# EAGLE design pc_ads1292r_brk (EAGLE 6.4)

## Sheet 1 of 2
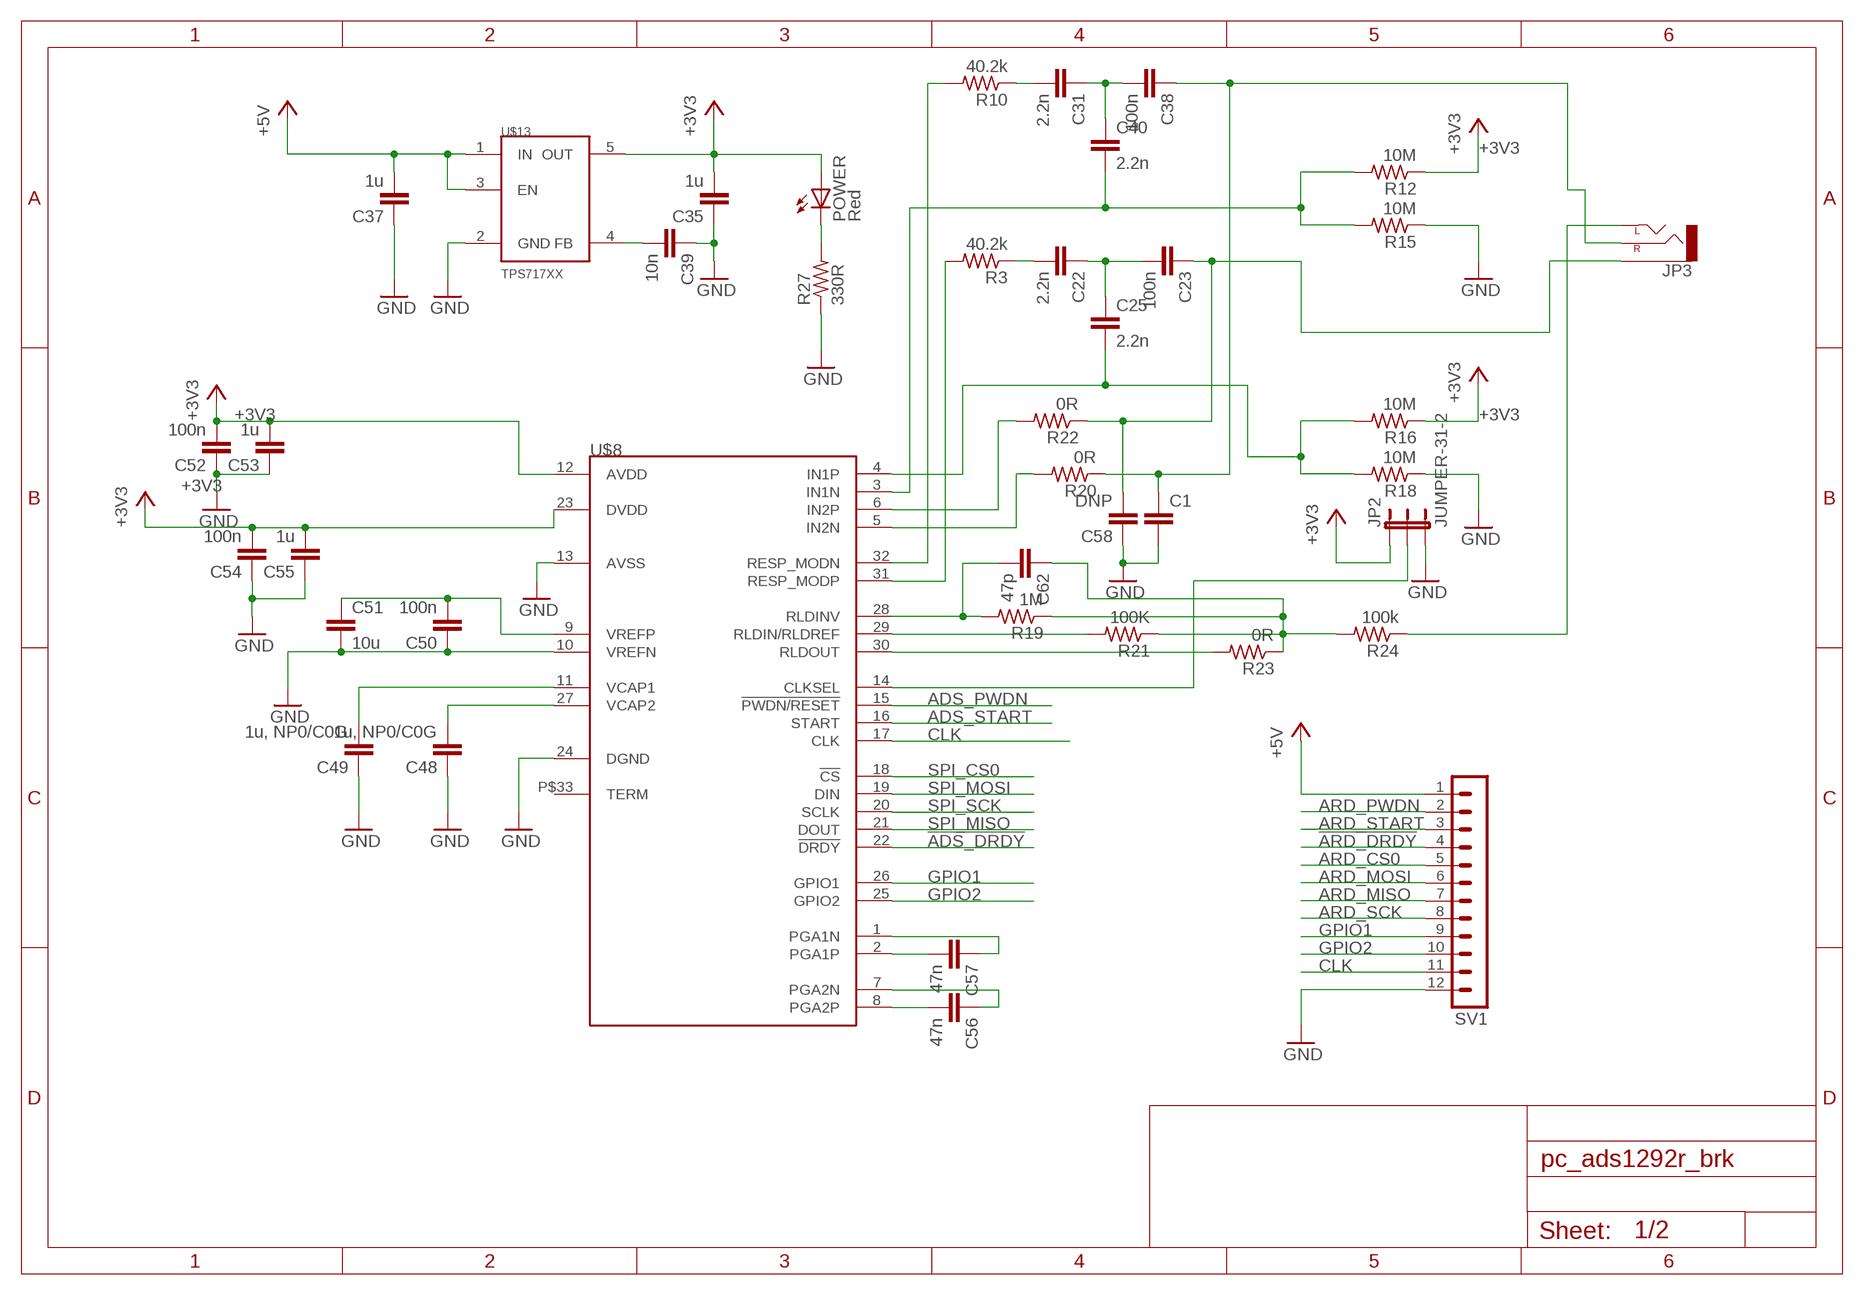
[diagram p0: schematic, sheet 1]

### Parts
C1  C-EUC0402  [C0402]
C22  2.2n  C-EUC0402  [C0402]
C23  100n  C-EUC0402  [C0402]
C25  2.2n  C-EUC0402  [C0402]
C31  2.2n  C-EUC0402  [C0402]
C35  1u  C-EUC0402  [C0402]
C37  1u  C-EUC0402  [C0402]
C38  100n  C-EUC0402  [C0402]
C39  10n  C-EUC0402  [C0402]
C40  2.2n  C-EUC0402  [C0402]
C48  1u, NP0/C0G  C-EUC0402  [C0402]
C49  1u, NP0/C0G  C-EUC0402  [C0402]
C50  100n  C-EUC0402  [C0402]
C51  10u  C-EUC0603  [C0603]
C52  100n  C-EUC0402  [C0402]
C53  1u  C-EUC0402  [C0402]
C54  100n  C-EUC0402  [C0402]
C55  1u  C-EUC0402  [C0402]
C56  47n  C-EUC0402  [C0402]
C57  47n  C-EUC0402  [C0402]
C58  DNP  C-EUC0402  [C0402]
C62  47p  C-EUC0402  [C0402]
JP2  JUMPER-31-2  [SJ_3_PASTE1&2]
JP3  AUDIO-JACKSMD2  [AUDIO-JACK-3.5MM-SMD]
POWER  Red  LEDCHIPLED_0603  [CHIPLED_0603]
R3  40.2k  R-US_R0402  [R0402]
R10  40.2k  R-US_R0402  [R0402]
R12  10M  R-US_R0402  [R0402]
R15  10M  R-US_R0402  [R0402]
R16  10M  R-US_R0402  [R0402]
R18  10M  R-US_R0402  [R0402]
R19  1M  R-US_R0402  [R0402]
R20  0R  R-US_R0402  [R0402]
R21  100K  R-US_R0402  [R0402]
R22  0R  R-US_R0402  [R0402]
R23  0R  R-US_R0402  [R0402]
R24  100k  R-US_R0402  [R0402]
R27  330R  R-US_R0402  [R0402]
SV1  MA12-1  [MA12-1]
U$8  ADS1292RPVQFN32  [S-PVQFN-N32]
U$13  TPS717XX  [SC70-5]

### Nets
!ADS_DRDY: U$8.22(!DRDY) ; also sheet 2
!ARD_DRDY: SV1.4 ; also sheet 2
+3V3: C35.2 C52.2 C53.2 C54.2 C55.2 JP2.1 POWER.A R12.1 R16.1 U$8.12(AVDD) U$8.23(DVDD) U$13.5(OUT) ; also sheet 2
+5V: C37.2 SV1.1 U$13.1(IN) U$13.3(EN) ; also sheet 2
ADS_PWDN: U$8.15(!PWDN/RESET) ; also sheet 2
ADS_START: U$8.16(START) ; also sheet 2
ARD_CS0: SV1.5 ; also sheet 2
ARD_MISO: SV1.7 ; also sheet 2
ARD_MOSI: SV1.6 ; also sheet 2
ARD_PWDN: SV1.2 ; also sheet 2
ARD_SCK: SV1.8 ; also sheet 2
ARD_START: SV1.3 ; also sheet 2
CLK: SV1.11 U$8.17(CLK)
GND: C1.2 C35.1 C37.1 C39.1 C48.1 C49.1 C50.1 C51.2 C52.1 C53.1 C54.1 C55.1 C58.1 JP2.3 R15.1 R18.1 R27.1 SV1.12 U$8.10(VREFN) U$8.13(AVSS) U$8.24(DGND) U$13.2(GND)
GPIO1: SV1.9 U$8.26(GPIO1)
GPIO2: SV1.10 U$8.25(GPIO2)
N$1: C39.2 U$13.4(FB)
N$7: POWER.C R27.2
N$8: R3.2 U$8.31(RESP_MODP)
N$10: C22.2 R3.1
N$11: C22.1 C23.2 C25.1
N$12: R22.2 U$8.6(IN2P)
N$14: R20.2 U$8.5(IN2N)
N$19: C48.2 U$8.27(VCAP2)
N$26: R10.2 U$8.32(RESP_MODN)
N$28: C31.2 R10.1
N$29: C31.1 C38.2 C40.1
N$30: C1.1 C38.1 JP3.RING(RIGHT) R20.1
N$31: C40.2 R12.2 R15.2 U$8.3(IN1N)
N$32: C25.2 R16.2 R18.2 U$8.4(IN1P)
N$33: R21.2 U$8.29(RLDIN/RLDREF)
N$34: C62.2 R19.2 U$8.28(RLDINV)
N$35: C62.1 R19.1 R21.1 R23.1 R24.2
N$36: C49.2 U$8.11(VCAP1)
N$37: C56.2 U$8.8(PGA2P)
N$38: C56.1 U$8.7(PGA2N)
N$40: C50.2 C51.1 U$8.9(VREFP)
N$41: C57.2 U$8.2(PGA1P)
N$43: C57.1 U$8.1(PGA1N)
N$45: C23.1 C58.2 JP3.SLEEVE R22.1
N$50: R23.2 U$8.30(RLDOUT)
N$51: JP3.TIP(LEFT) R24.1
N$104: JP2.2 U$8.14(CLKSEL)
SPI_CS0: U$8.18(!CS) ; also sheet 2
SPI_MISO: U$8.21(DOUT) ; also sheet 2
SPI_MOSI: U$8.19(DIN) ; also sheet 2
SPI_SCK: U$8.20(SCLK) ; also sheet 2
Unconnected: U$8.P$33(TERM)

## Sheet 2 of 2
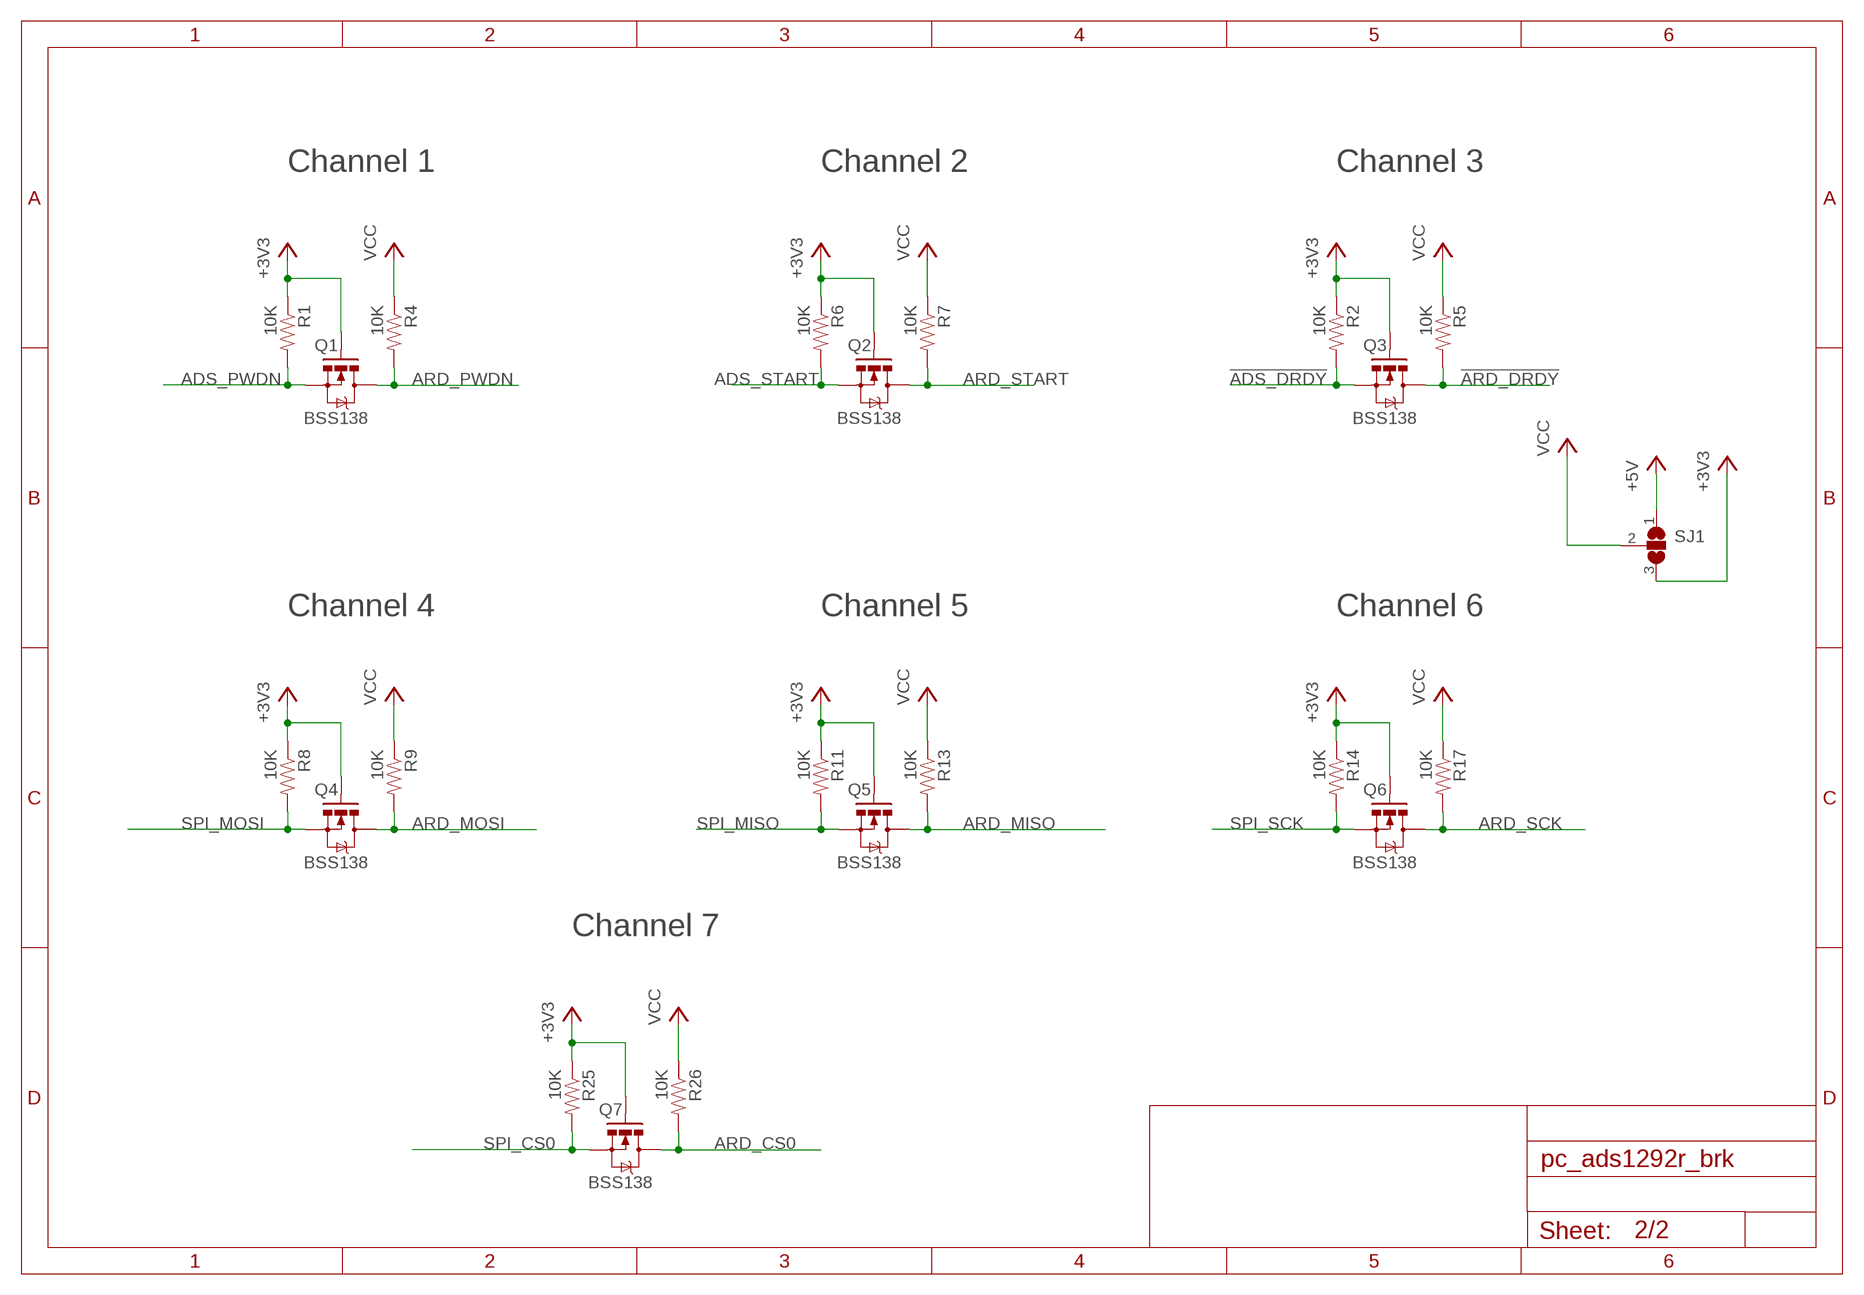
[diagram p1: schematic, sheet 2]

### Parts
Q1  BSS138  MOSFET-NCHANNELSMD  [SOT23-3]
Q2  BSS138  MOSFET-NCHANNELSMD  [SOT23-3]
Q3  BSS138  MOSFET-NCHANNELSMD  [SOT23-3]
Q4  BSS138  MOSFET-NCHANNELSMD  [SOT23-3]
Q5  BSS138  MOSFET-NCHANNELSMD  [SOT23-3]
Q6  BSS138  MOSFET-NCHANNELSMD  [SOT23-3]
Q7  BSS138  MOSFET-NCHANNELSMD  [SOT23-3]
R1  10K  RESISTOR0603-RES  [0603-RES]
R2  10K  RESISTOR0603-RES  [0603-RES]
R4  10K  RESISTOR0603-RES  [0603-RES]
R5  10K  RESISTOR0603-RES  [0603-RES]
R6  10K  RESISTOR0603-RES  [0603-RES]
R7  10K  RESISTOR0603-RES  [0603-RES]
R8  10K  RESISTOR0603-RES  [0603-RES]
R9  10K  RESISTOR0603-RES  [0603-RES]
R11  10K  RESISTOR0603-RES  [0603-RES]
R13  10K  RESISTOR0603-RES  [0603-RES]
R14  10K  RESISTOR0603-RES  [0603-RES]
R17  10K  RESISTOR0603-RES  [0603-RES]
R25  10K  RESISTOR0603-RES  [0603-RES]
R26  10K  RESISTOR0603-RES  [0603-RES]
SJ1  SJ2W  [SJ_2]

### Nets
!ADS_DRDY: Q3.2(S) R2.2 ; also sheet 1
!ARD_DRDY: Q3.3(D) R5.2 ; also sheet 1
+3V3: Q1.1(G) Q2.1(G) Q3.1(G) Q4.1(G) Q5.1(G) Q6.1(G) Q7.1(G) R1.1 R2.1 R6.1 R8.1 R11.1 R14.1 R25.1 SJ1.3 ; also sheet 1
+5V: SJ1.1 ; also sheet 1
ADS_PWDN: Q1.2(S) R1.2 ; also sheet 1
ADS_START: Q2.2(S) R6.2 ; also sheet 1
ARD_CS0: Q7.3(D) R26.2 ; also sheet 1
ARD_MISO: Q5.3(D) R13.2 ; also sheet 1
ARD_MOSI: Q4.3(D) R9.2 ; also sheet 1
ARD_PWDN: Q1.3(D) R4.2 ; also sheet 1
ARD_SCK: Q6.3(D) R17.2 ; also sheet 1
ARD_START: Q2.3(D) R7.2 ; also sheet 1
SPI_CS0: Q7.2(S) R25.2 ; also sheet 1
SPI_MISO: Q5.2(S) R11.2 ; also sheet 1
SPI_MOSI: Q4.2(S) R8.2 ; also sheet 1
SPI_SCK: Q6.2(S) R14.2 ; also sheet 1
VCC: R4.1 R5.1 R7.1 R9.1 R13.1 R17.1 R26.1 SJ1.2

### Notes on the sheet
- Channel 1 | Channel 2 | Channel 3
- Channel 4 | Channel 5 | Channel 6
- Channel 7

## Library data of the parts
C1 C22 C23 C25 C31 C35 C37-C40 C48-C50 C52-C58 C62 = rcl:C-EU: CAPACITOR, European symbol
C51 = resistor:C-EU: CAPACITOR, European symbol
JP2 = SparkFun:JUMPER-3
JP3 = SparkFun-Connectors:AUDIO-JACK: 3.5mm Audio Jack Simple 3.5mm common PCB mount audio jack. SKU: PRT-08032; PROD_ID: CONN-10353
POWER = led:LED: LED OSRAM: - CHIPLED LG R971, LG N971, LY N971, LG Q971, LY Q971, LO R971, LY R971 LH N974, LH R974 LS Q976, LO Q976, LY Q976 LO Q996 - Hyper CHIPLED LW Q18S LB Q993, LB Q99A, LB R99A - SideLED LS A670, LO A670, LY A670, LG A670, LP A670 LB A673, LV A673, LT A673, LW A673 LH A674 LY A675 LS A676, LA A676, LO A676, LY A676, LW A676 LS A679, LY A679, LG A679 - Hyper Micro SIDELED® LS Y876, LA Y876, LO Y876, LY Y876 LT Y87S - SmartLED LW L88C, LW L88S LB L89C, LB L89S, LG L890 LS L89K, LO L89K, LY L89K LS L896, LA L896, LO L896, LY L896 - TOPLED LS T670, LO T670, LY T670, LG T670, LP T670 LSG T670, LSP T670, LSY T670, LOP T670, LYG T670 LG T671, LOG T671, LSG T671 LB T673, LV T673, LT T673, LW T673 LH T674 LS T676, LA T676, LO T676, LY T676, LB T676, LH T676, LSB T676, LW T676 LB T67C, LV T67C, LT T67C, LS T67K, LO T67K, LY T67K, LW E67C LS E67B, LA E67B, LO E67B, LY E67B, LB E67C, LV E67C, LT E67C LW T67C LS T679, LY T679, LG T679 LS T770, LO T770, LY T770, LG T770, LP T770 LB T773, LV T773, LT T773, LW T773 LH T774 LS E675, LA E675, LY E675, LS T675 LS T776, LA T776, LO T776, LY T776, LB T776 LHGB T686 LT T68C, LB T68C - Hyper Mini TOPLED® LB M676 - Mini TOPLED Santana® LG M470 LS M47K, LO M47K, LY M47K Source: http://www.osram.convergy.de LUXEON: - LUMILED® LXK2-PW12-R00, LXK2-PW12-S00, LXK2-PW14-U00, LXK2-PW14-V00 LXK2-PM12-R00, LXK2-PM12-S00, LXK2-PM14-U00 LXK2-PE12-Q00, LXK2-PE12-R00, LXK2-PE12-S00, LXK2-PE14-T00, LXK2-PE14-U00 LXK2-PB12-K00, LXK2-PB12-L00, LXK2-PB12-M00, LXK2-PB14-N00, LXK2-PB14-P00, LXK2-PB14-Q00 LXK2-PR12-L00, LXK2-PR12-M00, LXK2-PR14-Q00, LXK2-PR14-R00 LXK2-PD12-Q00, LXK2-PD12-R00, LXK2-PD12-S00 LXK2-PH12-R00, LXK2-PH12-S00 LXK2-PL12-P00, LXK2-PL12-Q00, LXK2-PL12-R00 Source: www.luxeon.com KINGBRIGHT: KA-3528ASYC Source: www.kingbright.com
Q1-Q7 = SparkFun:MOSFET-NCHANNEL
R1 R2 R4-R9 R11 R13 R14 R17 R25 R26 = SparkFun:RESISTOR: Resistor Basic schematic elements and footprints for 0603, 1206, and PTH resistors.
R3 R10 R12 R15 R16 R18-R24 R27 = rcl:R-US_: RESISTOR, American symbol
SJ1 = jumper:SJ2W: SMD solder JUMPER
SV1 = con-lstb:MA12-1: PIN HEADER; OC_FARNELL: unknown; OC_NEWARK: unknown
U$8 = circuitects:ADS1292R
U$13 = circuitects:TPS717XX

## Board
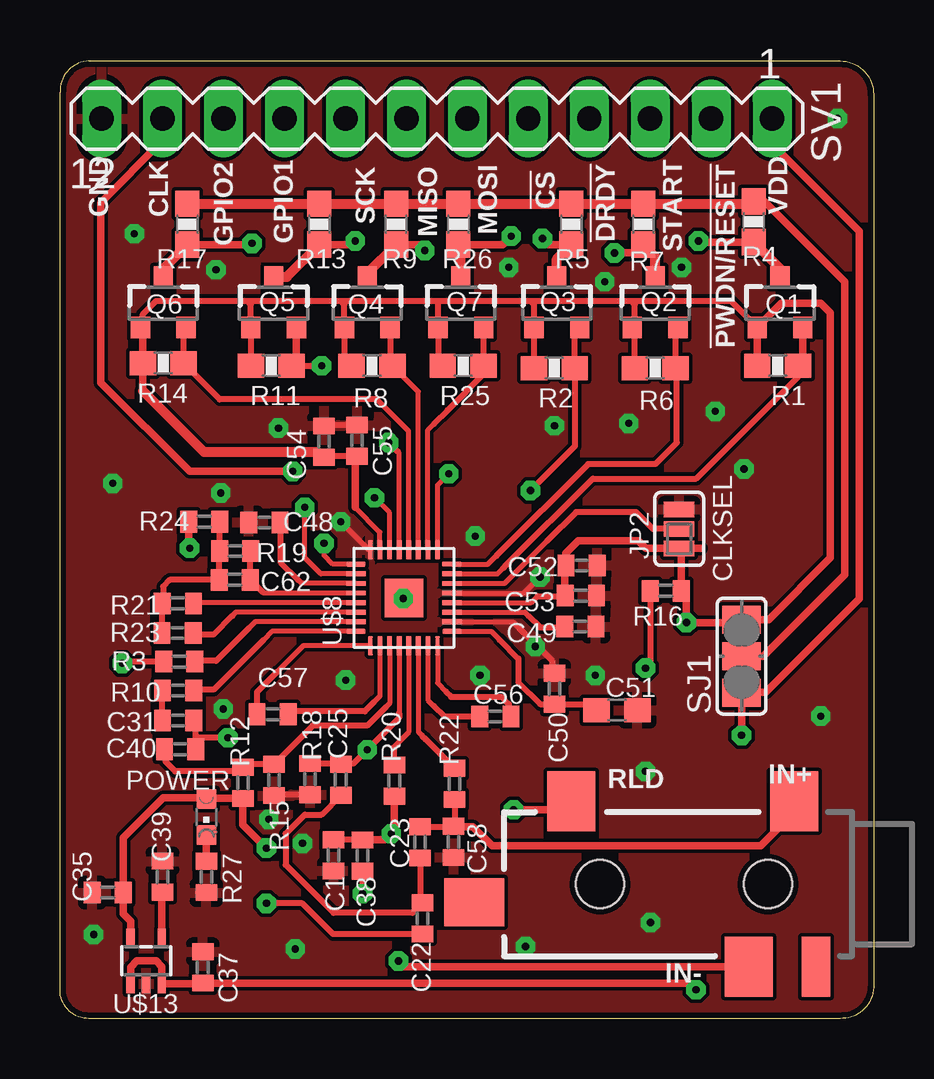
[diagram p2: board, top side]
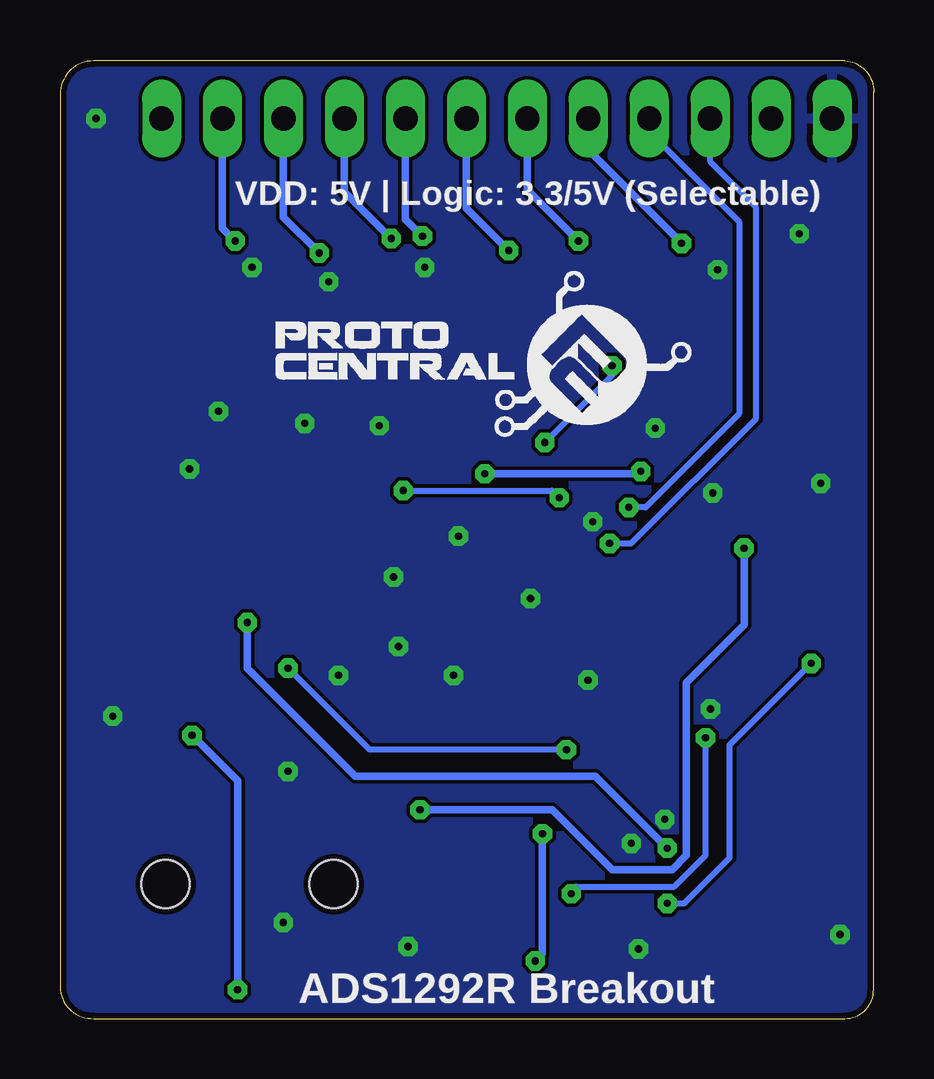
[diagram p3: board, bottom side, seen from below]

Size 33.9 x 39.9 mm. Coordinates in mm from the lower left corner, seen from the top.
Outline: 1.2,39.9 32.5,39.9 arc-90 33.9,38.5 33.9,1.3 arc-90 32.5,0 1.2,0 arc-90 0,1.2 0,38.6 arc-90 1.2,39.9
Copper layers (1*2*15*16): Top 0.035mm / dielectric 1.5mm / Route2 0.035mm / dielectric 0.15mm / Route15 0.035mm / dielectric 0.2mm / Bottom 0.035mm
Design rules "Circuitects-Rules": minimum track width 6mil, minimum drill 0.3mm, track to track 6mil, track to pad 6mil, pad to pad 6mil, via to via 6mil, smd to smd 6mil, copper to edge 10mil, drill to drill 8mil, minimum pad ring 12mil, minimum via ring 10mil, stop-mask expansion 4mil, vias tented up to drill 25mil, thermal gap 10mil

### Footprints (pad centres in the part's own frame; a part is rotated, then mirrored left to right if it is on the bottom)
C0402 = smd 0.7 x 0.9: 1 -0.65,0; 2 0.65,0
C0603 = smd 1.1 x 1: 1 -0.85,0; 2 0.85,0
SJ_3_PASTE1&2 = smd 0.635 x 1.27: 1 -0.813,0; 2 0,0; 3 0.813,0
AUDIO-JACK-3.5MM-SMD = smd 2 x 2.5: RING 4.3,3.45; SLEEVE 2.4,-3.45; TIP 11.7,-3.45 | smd 1.2 x 2.5: RSH 1.5,3.45 | smd 2.5 x 2: TSH 15.75,0.75 | hole 2: 3.5,0; 10.5,0
CHIPLED_0603 = smd 0.8 x 0.8: A 0,-0.75; C 0,0.75
SOT23-3 = smd 0.8 x 0.9: 1 -0.95,-1; 2 0.95,-1; 3 0,1.1
0603-RES = smd 1.1 x 1: 1 -0.85,0; 2 0.85,0
R0402 = smd 0.7 x 0.9: 1 -0.65,0; 2 0.65,0
SJ_2 = smd 1.168 x 1.6: 1 -1.524,0; 2 0,0; 3 1.524,0
MA12-1 = drill 1.016 long: 1 -13.97,0; 2 -11.43,0; 3 -8.89,0; 4 -6.35,0; 5 -3.81,0; 6 -1.27,0; 7 1.27,0; 8 3.81,0; 9 6.35,0; 10 8.89,0; 11 11.43,0; 12 13.97,0
S-PVQFN-N32 = smd 0.8 x 0.2: 1 -2,1.4; 2 -2,1; 3 -2,0.6; 4 -2,0.2; 5 -2,-0.2; 6 -2,-0.6; 7 -2,-1; 8 -2,-1.4; 17 2,-1.4; 18 2,-1; 19 2,-0.6; 20 2,-0.2; 21 2,0.2; 22 2,0.6; 23 2,1; 24 2,1.4 | smd 0.2 x 0.8: 9 -1.4,-2; 10 -1,-2; 11 -0.6,-2; 12 -0.2,-2; 13 0.2,-2; 14 0.6,-2; 15 1,-2; 16 1.4,-2; 25 1.4,2; 26 1,2; 27 0.6,2; 28 0.2,2; 29 -0.2,2; 30 -0.6,2; 31 -1,2; 32 -1.4,2 | smd 1.6 x 1.6: P$33 0,0
SC70-5 = smd 0.35 x 0.8: 1 -0.65,-0.95; 2 0,-0.95; 3 0.65,-0.95; 4 0.65,0.95; 5 -0.65,0.95

### Placement (x,y rotation side)
C1  11.4,6.8 270 top
C22  15.1,4.17 270 top
C23  15,7.34 270 top
C25  11.7,9.95 90 top
C31  4.92,12.42 180 top
C35  1.99,5.25 0 top
C37  5.95,2.13 270 top
C38  12.6,6.79 270 top
C39  4.27,5.91 270 top
C40  5,11.22 180 top
C48  8.52,20.67 0 top
C49  21.68,16.33 180 top
C50  20.6,13.74 270 top
C51  23.21,12.84 0 top
C52  21.73,18.88 180 top
C53  21.7,17.62 180 top
C54  11,24.04 270 top
C55  12.38,24.08 270 top
C56  18.14,12.58 0 top
C57  8.86,12.68 0 top
C58  16.4,7.36 90 top
C62  7.28,18.28 0 top
JP2  25.8,20.4 90 top
JP3  33,5.6 180 top
POWER  6.1,8.4 180 top
Q1  30,29.8 0 top
Q2  24.8,29.8 0 top
Q3  20.7,29.8 0 top
Q4  12.8,29.8 0 top
Q5  8.9,29.8 0 top
Q6  4.3,29.8 0 top
Q7  16.7,29.8 0 top
R1  29.9,27.2 0 top
R2  20.6,27.1 0 top
R3  4.97,14.87 0 top
R4  28.9,33.2 270 top
R5  21.3,33.1 270 top
R6  24.8,27.1 0 top
R7  24.3,33.1 270 top
R8  13,27.2 0 top
R9  14,33.1 270 top
R10  4.92,13.67 0 top
R11  8.8,27.2 0 top
R12  7.62,9.82 90 top
R13  10.8,33.1 270 top
R14  4.3,27.3 0 top
R15  8.92,9.94 90 top
R16  25.24,17.82 180 top
R17  5.3,33.1 270 top
R18  10.42,9.98 90 top
R19  7.3,19.48 0 top
R20  13.93,9.91 90 top
R21  4.91,17.3 0 top
R22  16.44,9.78 90 top
R23  4.9,16.06 0 top
R24  6.01,20.7 0 top
R25  16.8,27.2 0 top
R26  16.6,33.1 270 top
R27  6.1,5.9 90 top
SJ1  28.4,15.1 90 top
SV1  15.7,37.5 180 top
U$2  [PROTY_WITH_TEXT]  26,24.2 0 bottom
U$8  14.33,17.53 90 top
U$13  3.59,2.4 0 top

### Tracks (layer width: path | path; a pad name or v marks a point on that pad's centre or on a via)
!ADS_DRDY  (via drill 0.3)
  Top 0.2: U$8.22 13.73,21.07 v13.1,21.7
  Top 0.254: Q3.2 21.45,28.6 R2.2 21.45,23.85 v19.6,22
  Bottom 0.254: v19.6,22 13.4,22 v13.1,21.7
!ARD_DRDY  (via drill 0.3)
  Top 0.305: R5.2 20.35,32.25 v20.1,32.5
  Top 0.406: Q3.3 20.7,31.65 R5.2
  Bottom 0.305: SV1.4 22.05,34.45 v20.1,32.5
+3V3  (via drill 0.3)
  Top 0.152: C54.2 10.9,23.4 10.7,23.6
  Top 0.2: U$8.12 19.63,17.33 19.9,17.6 | U$8.23 13.33,20.27 12.3,21.3
  Top 0.254: C55.2 11.04,23.43 C54.2 | R2.1 Q3.1 19.75,29.75 19.6,29.9 | Q6.1 3.45,28.7 3.45,29.35 4,29.9 7.8,29.9 | R6.1 23.95,28.7 | 23.95,28.7 Q2.1 | R8.1 11.85,27.5 Q4.1 11.85,29.75 11.7,29.9 | 7.8,29.9 11.7,29.9 | 11.7,29.9 15.8,29.9 | 15.8,29.9 19.6,29.9 | 19.6,29.9 23.8,29.9 | 23.8,29.9 27.95,29.9 Q1.1 | 23.95,28.7 23.95,29.75 23.8,29.9 | 15.8,29.9 15.75,29.85 Q7.1 15.75,27.4 R25.1 | 7.8,29.9 7.95,29.75 Q5.1 R11.1 | 19.9,17.6 21.03,17.6 C53.2
  Top 0.305: 3.45,26.15 R14.1 3.45,28.7 | C54.2 | 21.03,17.6 21.03,18.83 C52.2 21.08,19.38 21.6,19.9 24.1,19.9 24.4,19.6 25.79,19.6 | 12.3,21.3 12.3,23.35 C55.2 | 25.79,19.6 26.7,19.6 | 25.79,19.6 JP2.1 25.89,19.5 R16.1 26.1,17.61 v26.1,16.5 28.28,16.5 SJ1.3 29.52,16.62 32.1,19.2 32.1,29.4 31.7,29.8 30.05,29.8 Q1.1 R1.1 | U$13.5 2.94,4.06 2.64,4.36 C35.2 2.64,7.54 4.3,9.2 6.05,9.2 POWER.A 6.12,9.17 R12.1 7.62,8.08 v8.6,7.1
  Top 0.406: 10.7,23.6 6,23.6 3.45,26.15
  Bottom 0.305: v26.1,16.5 26.1,14.6 21.6,10.1 11.6,10.1 v8.6,7.1
+5V  (via drill 0.3)
  Top 0.305: U$13.1 2.94,2.14 3.2,2.4 4,2.4 4.24,2.16 U$13.3 5.92,1.45 C37.2 26.22,1.48 v26.5,1.2 | SV1.1 29.67,36.43 33.3,32.8 33.3,17.5 29.4,13.6 28.42,13.6 SJ1.1 v28.4,11.8
  Bottom 0.305: v26.5,1.2 26.5,9.9 v28.4,11.8
ADS_PWDN
  Top 0.2: U$8.15 18.23,18.53 18.6,18.9
  Top 0.254: 18.48,18.78 18.6,18.9 22.2,22.5 26.5,22.5 30.75,26.75 R1.2
  Top 0.305: Q1.2 30.95,27.4 R1.2
ADS_START
  Top 0.2: U$8.16 17.83,18.93 18.18,19.28
  Top 0.254: Q2.2 25.65,28.7 R6.2 25.7,27.05 25.7,24 24.8,23.1 22,23.1 18.18,19.28
ARD_CS0  (via drill 0.3)
  Top 0.305: R26.2 18.45,32.25 v18.8,32.6
  Top 0.406: Q7.3 16.7,32.15 R26.2
  Bottom 0.305: SV1.5 19.51,33.31 v18.8,32.6
ARD_MISO  (via drill 0.3)
  Top 0.305: R13.2 12.15,32.25 v12.3,32.4
  Top 0.406: Q5.3 9.45,30.9 R13.2
  Bottom 0.305: SV1.7 14.43,34.53 v12.3,32.4
ARD_MOSI  (via drill 0.3)
  Top 0.305: R9.2 14.95,32.25 v15.2,32
  Top 0.406: Q4.3 12.8,31.05 R9.2
  Bottom 0.305: SV1.6 16.97,33.77 v15.2,32
ARD_PWDN  (via drill 0.3)
  Top 0.305: R4.2 26.65,32.35 v26.6,32.4
  Top 0.406: Q1.3 30,31.25 R4.2
  Bottom 0.305: SV1.2 27.13,32.93 v26.6,32.4
ARD_SCK  (via drill 0.3)
  Top 0.305: R17.2 7.95,32.25 v8,32.3
  Top 0.406: Q6.3 4.3,31.25 R17.2
  Bottom 0.305: SV1.8 11.89,36.19 v8,32.3
ARD_START  (via drill 0.3)
  Top 0.305: R7.2 24.3,32.1 24.1,31.9 v23.1,31.9
  Top 0.406: Q2.3 24.8,31.75 R7.2
  Bottom 0.305: SV1.3 24.59,33.39 v23.1,31.9
CLK  (via drill 0.3)
  Top 0.2: U$8.17 15.73,22.23 v16.2,22.7
  Top 0.305: SV1.11 4.27,36.57 1.7,34 1.7,26.5 5.4,22.8 v9.7,22.8
  Bottom 0.305: v16.2,22.7 9.9,22.7 v9.7,22.8
GND  (via drill 0.3)
  Top 0.2: U$8.10 18.87,16.53 19.12,16.28 | U$8.13 19.33,17.73 v20,18.4 | U$8.24 12.87,19.53 v11.7,20.7 | v14.3,17.5 14.4,17.5 14.6,17.7
  Top 0.254: R18.1 8.96,9.33 R15.1 | 19.12,16.28 20.5,14.9 20.5,14.49 C50.1 | C55.1 11.04,24.73 C54.1
  Top 0.305: R27.1 5.78,5.25
  other vias: 20.6,24.7 24.6,4 31.7,12.6 17.3,20.1 10.1,7.3 8.7,8.3 9.1,24.6 6.8,12.9 17.5,14.3 23.7,24.8 27.3,25.3 25.9,31.3 22.7,30.7 2.2,22.3 3.1,32.7 6.5,31.2 1.4,3.5 11.9,14.1 19.8,15.5 22.3,14.3 6.7,21.9 28.5,22.9 9.8,2.9 19.4,3 24.4,10.3 18.7,31.3 32.4,37.5
  pour Top: -0.5,40.4 34.3,40.8 34.1,-0.1 -0.1,-0.1
  pour Bottom: -0.5,40.3 34.1,41 33.9,-0.2 -0.3,-0.2
GPIO1  (via drill 0.3)
  Top 0.2: U$8.26 10.87,18.53 10.2,19.2 v10.2,21.3
  Bottom 0.254: SV1.9 9.35,36.95 5.6,33.2 5.6,25.2 9.5,21.3 v10.2,21.3
GPIO2  (via drill 0.3)
  Top 0.2: U$8.25 11.37,18.93 11,19.3 v11,19.8
  Bottom 0.254: v11,19.8 10.1,19.8 4.9,25 4.9,33.8 6.8,35.7 SV1.10
N$1
  Top 0.305: U$13.4 4.24,5.23 C39.2
N$7
  Top 0.305: POWER.C R27.2
N$8
  Top 0.2: U$8.31 8.13,16.53 7.88,16.28
  Top 0.254: 7.88,16.28 6.5,14.9 5.65,14.9 R3.2
N$10  (via drill 0.3)
  Top 0.254: v8.6,4.8 10.1,4.8 11.38,3.52 C22.2 | R3.1 2.67,14.87 v2.6,14.8
  Bottom 0.254: v8.6,4.8 7.9,4.8 6,6.7 6,11.4 v2.6,14.8
N$11
  Top 0.254: C23.2 15,4.92 C22.1 14.68,4.4 11.4,4.4 9.4,6.4 9.4,7.7 10.2,8.5 10.9,8.5 C25.1
N$12
  Top 0.2: U$8.6 14.93,11.94 15.24,11.63
  Top 0.254: 15.08,11.79 15.24,11.63 R22.2
N$14
  Top 0.2: U$8.5 14.53,11.93 13.9,11.3
  Top 0.254: 13.9,11.3 13.9,10.59 R20.2
N$19
  Top 0.2: U$8.27 10.07,18.13 9.92,18.28
  Top 0.254: 9.92,18.28 9.2,19 9.2,20.84 C48.2
N$26
  Top 0.2: U$8.32 8.83,16.13 8.48,15.78
  Top 0.254: 8.48,15.78 6.4,13.7 5.6,13.7 R10.2
N$28
  Top 0.254: C31.2 R10.1
N$29  (via drill 0.3)
  Top 0.254: C40.1 5.65,11.8 | 5.65,11.8 5.65,12.34 C31.1 | C38.2 v12.6,5.2 | v7,11.7 5.75,11.7 5.65,11.8
  Bottom 0.254: v12.6,5.2 12.6,5.3 12.4,5.5 8.3,5.5 7,6.8 v7,11.7
N$30  (via drill 0.3)
  Top 0.254: C38.1 C1.1
  Top 0.305: JP3.RING 14.35,2.15 v14.1,2.4 | R20.1 13.93,7.83 v13.8,7.7 13.54,7.44 C38.1
  Bottom 0.305: v13.8,7.7 13.8,2.7 v14.1,2.4
N$31
  Top 0.2: U$8.3 13.73,13.13 13.58,12.98
  Top 0.254: 13.58,12.98 12.8,12.2 10.53,12.2 R15.2 7.7,10.59 R12.2 7.57,10.67 7.2,10.3 4.8,10.3 4.4,10.7 4.4,11.17 C40.2
N$32  (via drill 0.3)
  Top 0.2: U$8.4 14.13,12.73
  Top 0.254: R18.2 11.97,10.63 | 11.97,10.63 C25.2 | 14.13,12.73 14.13,12.53 v12.8,11.2 12.23,10.63 11.97,10.63 | R16.2 24.59,14.79 v24.4,14.6
  Bottom 0.254: v12.8,11.2 21,11.2 v24.4,14.6
N$33
  Top 0.2: U$8.29 5.59,17.33 R21.2
  Top 0.254: 5.58,17.28 R21.2
N$34
  Top 0.2: U$8.28 8.48,17.73 8.43,17.78
  Top 0.254: R19.2 7.93,19.56 C62.2 8.43,17.78
N$35
  Top 0.254: R24.2 6.65,20.79 R19.1 6.63,19.56 C62.1 4.58,18.28 4.3,18 4.3,17.34 R21.1 R23.1
N$36
  Top 0.2: U$8.11 19.37,16.93 19.52,16.78
  Top 0.254: 19.52,16.78 20,16.3 21,16.3 C49.2
N$37
  Top 0.2: U$8.8 15.73,13.97 16.08,13.62
  Top 0.254: 16.08,13.62 16.3,13.4 18.4,13.4 18.7,13.1 18.7,12.67 C56.2
N$38
  Top 0.2: U$8.7 15.33,13.27 15.58,13.02
  Top 0.254: 15.58,13.02 16,12.6 17.47,12.6 C56.1
N$40
  Top 0.2: U$8.9 17.97,16.13 18.32,15.78
  Top 0.254: 18.32,15.78 19.1,15 19.1,14 20,13.1 C50.2 22.31,13.09 C51.1
N$41
  Top 0.2: U$8.2 13.33,13.43 13.08,13.18
  Top 0.254: 13.08,13.18 12.7,12.8 9.63,12.8 C57.2
N$43
  Top 0.2: U$8.1 10.13,15.53 9.03,14.43
  Top 0.254: 9.03,14.43 8.2,13.6 C57.1
N$45
  Top 0.254: C23.1 16.38,7.99 C58.2 16.44,8.05 R22.1
  Top 0.305: JP3.SLEEVE 30.6,8.6 29.2,7.2 18,7.2 17.2,8 C58.2
N$50
  Top 0.2: U$8.30 7.33,16.93 7.18,16.78
  Top 0.254: 7.18,16.78 6.4,16 5.61,16 R23.2
N$51  (via drill 0.3)
  Top 0.305: R24.1 5.36,19.64 v5.4,19.6 | v18.9,8.7 20.95,8.7 JP3.TIP
  Bottom 0.305: v5.4,19.6 5.4,16.4 7.8,14 7.8,6.8 8.4,6.2 10.9,6.2 13.4,8.7 v18.9,8.7
N$104
  Top 0.2: U$8.14 18.53,18.13 20.3,19.9
  Top 0.254: 20.3,19.9 21.5,21.1 24,21.1 24.7,20.4 JP2.2
SPI_CS0
  Top 0.2: U$8.18 15.33,24.53 16.15,25.35
  Top 0.254: Q7.2 R25.2 17.7,27.15 17.7,26.9 16.15,25.35 15.58,24.78
SPI_MISO  (via drill 0.3)
  Top 0.2: U$8.21 14.13,23.57 14.08,23.62
  Top 0.254: 14.08,23.62 v13.7,24 | R11.2 v10.9,27.2
  Top 0.305: Q5.2 9.85,27.4 R11.2
  Bottom 0.254: v10.9,27.2 10.9,26.8 v13.7,24
SPI_MOSI
  Top 0.2: U$8.19 14.93,26.12 R8.2
  Top 0.254: 13.7,27.15 R8.2 13.75,27.3 Q4.2
SPI_SCK
  Top 0.2: U$8.20 14.53,24.47 13.2,25.8
  Top 0.254: Q6.2 5.15,28.7 R14.2 6.65,25.8 13.2,25.8
VCC
  Top 0.305: R4.1 29.35,34.05 32.7,30.7 32.7,18.5 29.3,15.1 SJ1.2
  Top 0.406: R17.1 R13.1 R9.1 R26.1 R5.1 R7.1 28.8,33.95 R4.1

### Text on the board
tPlace: SCK | MISO | MOSI | !DRDY | START | !PWDN/RESET | !CS | GND | CLK | VDD | GPIO2 | GPIO1 | CLKSEL | RLD | IN+ | IN-
bPlace: VDD: 5V | Logic: 3.3/5V (Selectable) | ADS1292R Breakout